# Altium schematic sheet SimpleFPGA_SI_Demo.SchDoc
size A3
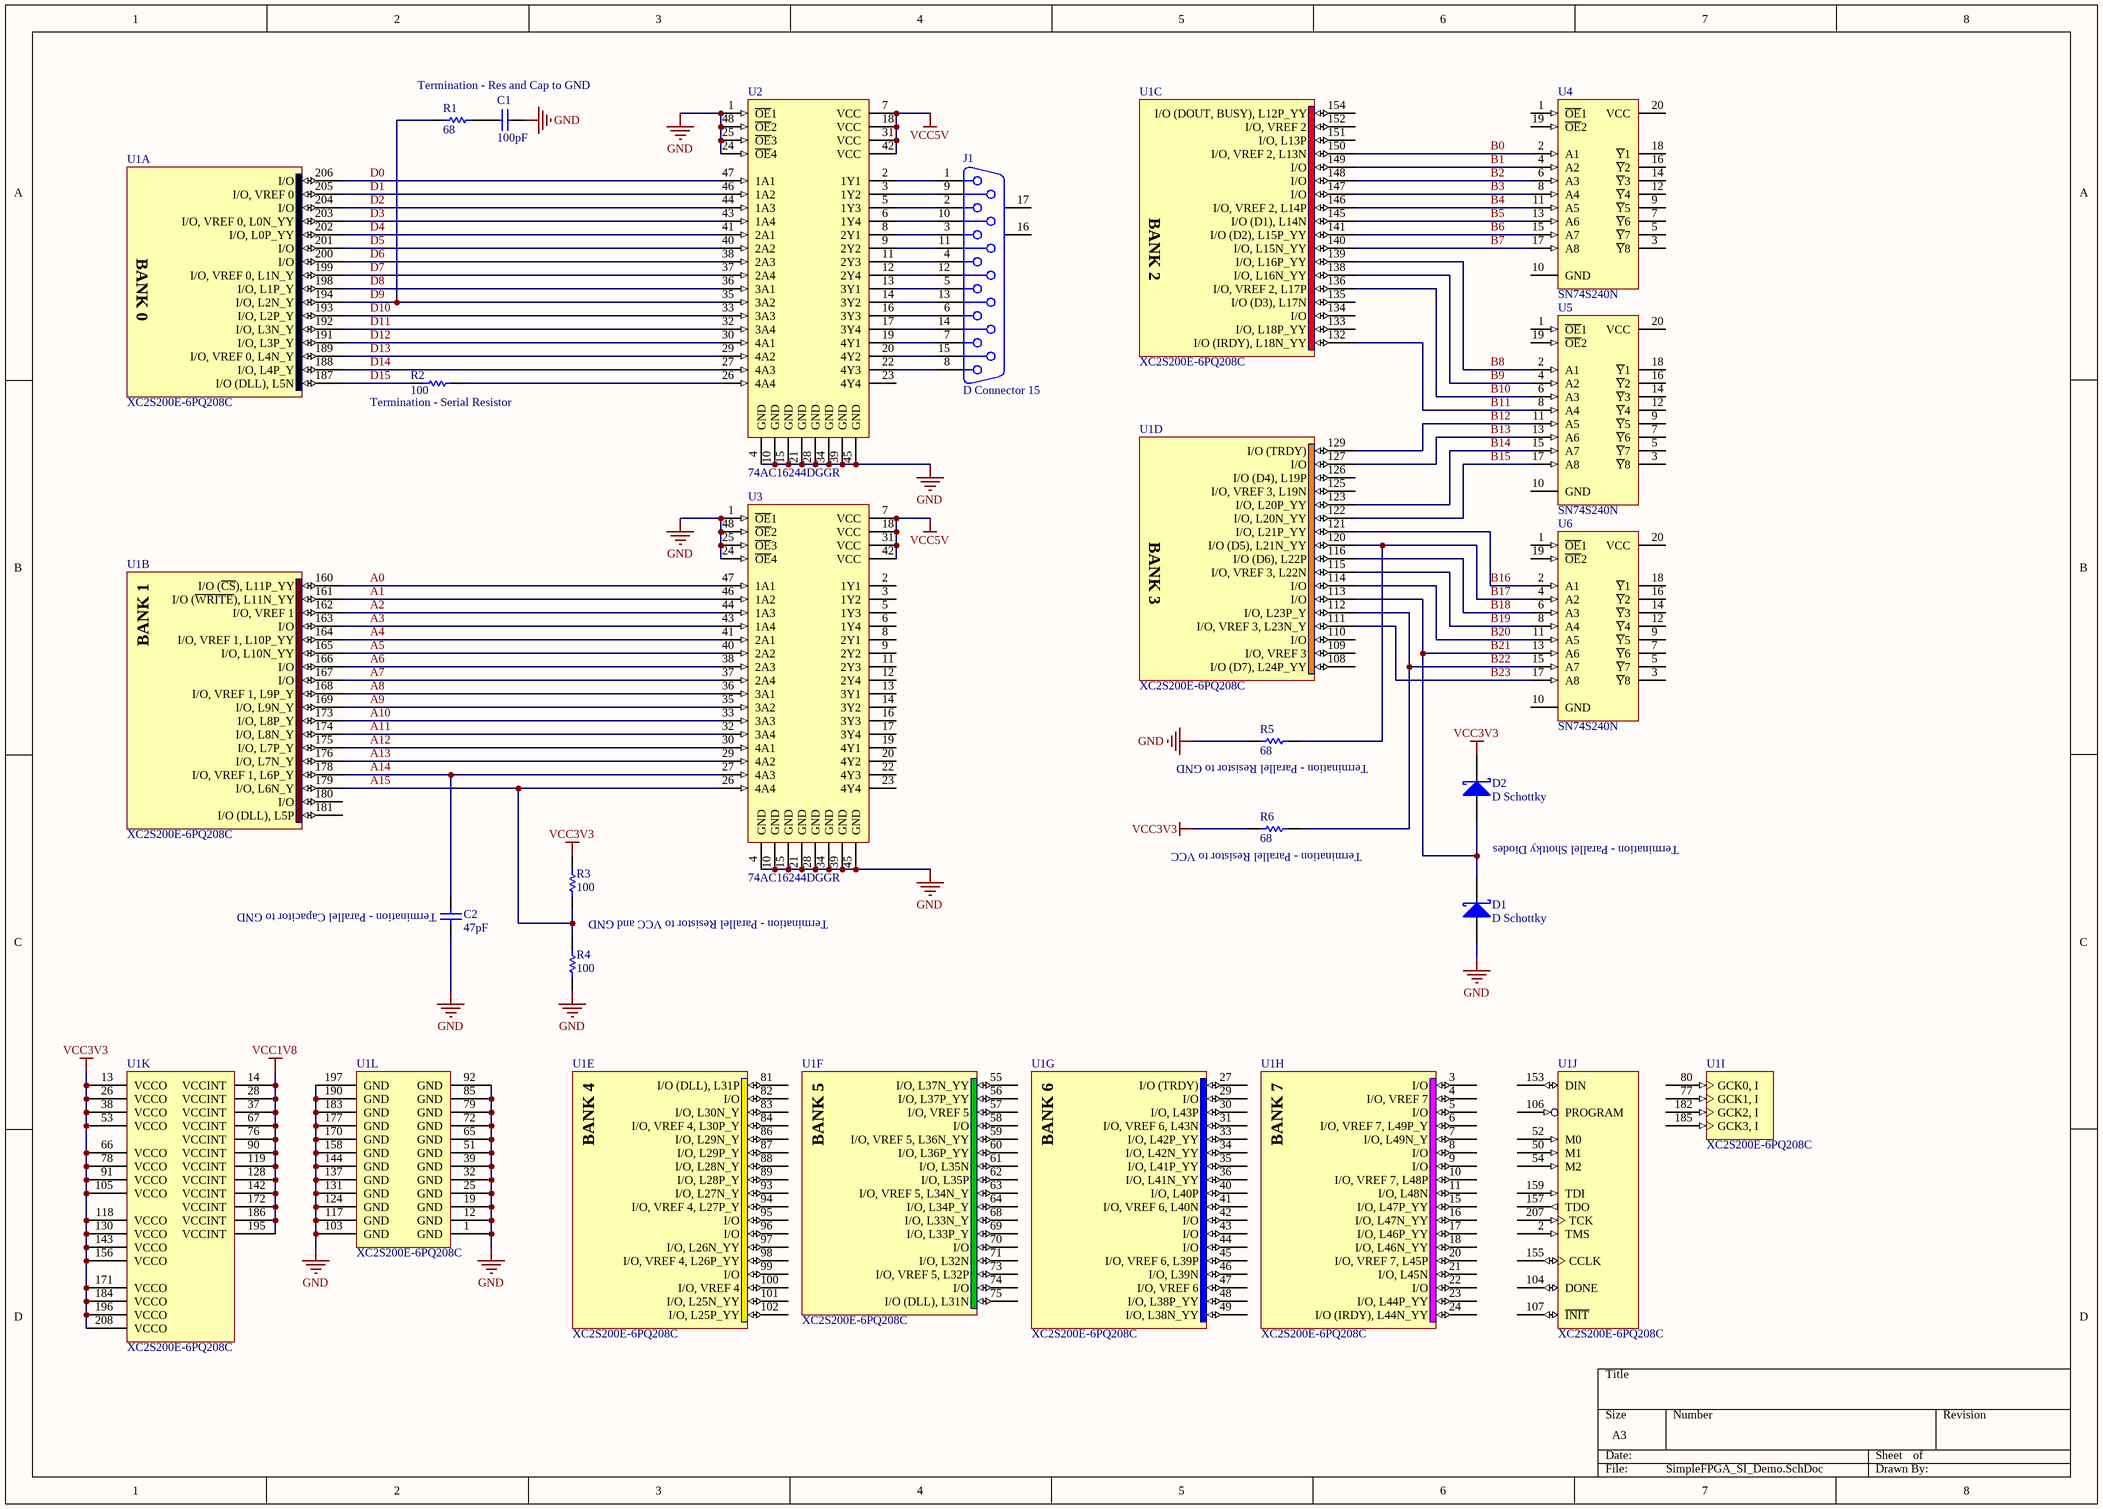
[diagram p0: SimpleFPGA_SI_Demo.SchDoc]

## Parts
C1  value 100pF  [RAD-0.3]  (hidden comment: Cap)
C2  value 47pF  [RAD-0.3]  (hidden comment: Cap)
D1  D Schottky  [SMB]
D2  D Schottky  [SMB]
J1  D Connector 15  [DSUB1.385-2H15]
R1  value 68  [AXIAL-0.3]  (hidden comment: Res1)
R2  value 100  [AXIAL-0.3]  (hidden comment: Res1)
R3  value 100  [AXIAL-0.3]  (hidden comment: Res1)
R4  value 100  [AXIAL-0.3]  (hidden comment: Res1)
R5  value 68  [AXIAL-0.3]  (hidden comment: Res1)
R6  value 68  [AXIAL-0.3]  (hidden comment: Res1)
U1  XC2S200E-6PQ208C  [PQ208_N]  (parts A,B,C,D,E,F,G,H,I,J,K,L of 12)
U2  74AC16244DGGR  [DGG048]
U3  74AC16244DGGR  [DGG048]
U4  SN74S240N  [N020]
U5  SN74S240N  [N020]
U6  SN74S240N  [N020]

## Nets
GND: C1.2 C2.1 D1.1(A) R4.1 R5.1 U1.1(GND) U1.12(GND) U1.19(GND) U1.25(GND) U1.32(GND) U1.39(GND) U1.51(GND) U1.65(GND) U1.72(GND) U1.79(GND) U1.85(GND) U1.92(GND) U1.103(GND) U1.117(GND) U1.124(GND) U1.131(GND) U1.137(GND) U1.144(GND) U1.158(GND) U1.170(GND) U1.177(GND) U1.183(GND) U1.190(GND) U1.197(GND) U2.1(~{OE}1) U2.4(GND) U2.10(GND) U2.15(GND) U2.21(GND) U2.24(~{OE}4) U2.25(~{OE}3) U2.28(GND) U2.34(GND) U2.39(GND) U2.45(GND) U2.48(~{OE}2) U3.1(~{OE}1) U3.4(GND) U3.10(GND) U3.15(GND) U3.21(GND) U3.24(~{OE}4) U3.25(~{OE}3) U3.28(GND) U3.34(GND) U3.39(GND) U3.45(GND) U3.48(~{OE}2)
VCC1V8: U1.14(VCCINT) U1.28(VCCINT) U1.37(VCCINT) U1.67(VCCINT) U1.76(VCCINT) U1.90(VCCINT) U1.119(VCCINT) U1.128(VCCINT) U1.142(VCCINT) U1.172(VCCINT) U1.186(VCCINT) U1.195(VCCINT)
VCC3V3: D2.2(K) R3.2 R6.1 U1.13(VCCO) U1.26(VCCO) U1.38(VCCO) U1.53(VCCO) U1.66(VCCO) U1.78(VCCO) U1.91(VCCO) U1.105(VCCO) U1.118(VCCO) U1.130(VCCO) U1.143(VCCO) U1.156(VCCO) U1.171(VCCO) U1.184(VCCO) U1.196(VCCO) U1.208(VCCO)
VCC5V: U2.7(VCC) U2.18(VCC) U2.31(VCC) U2.42(VCC) U3.7(VCC) U3.18(VCC) U3.31(VCC) U3.42(VCC)
A0: U1.160(I/O_(~{CS}),_L11P_YY) U3.47(1A1)
A1: U1.161(I/O_(~{WRITE}),_L11N_YY) U3.46(1A2)
A2: U1.162(I/O,_VREF_1) U3.44(1A3)
A3: U1.163(I/O) U3.43(1A4)
A4: U1.164(I/O,_VREF_1,_L10P_YY) U3.41(2A1)
A5: U1.165(I/O,_L10N_YY) U3.40(2A2)
A6: U1.166(I/O) U3.38(2A3)
A7: U1.167(I/O) U3.37(2A4)
A8: U1.168(I/O,_VREF_1,_L9P_Y) U3.36(3A1)
A9: U1.169(I/O,_L9N_Y) U3.35(3A2)
A10: U1.173(I/O,_L8P_Y) U3.33(3A3)
A11: U1.174(I/O,_L8N_Y) U3.32(3A4)
A12: U1.175(I/O,_L7P_Y) U3.30(4A1)
A13: U1.176(I/O,_L7N_Y) U3.29(4A2)
A14: C2.2 U1.178(I/O,_VREF_1,_L6P_Y) U3.27(4A3)
A15: R3.1 R4.2 U1.179(I/O,_L6N_Y) U3.26(4A4)
B0: U1.150(I/O,_VREF_2,_L13N) U4.2(A1)
B1: U1.149(I/O) U4.4(A2)
B2: U1.148(I/O) U4.6(A3)
B3: U1.147(I/O) U4.8(A4)
B4: U1.146(I/O,_VREF_2,_L14P) U4.11(A5)
B5: U1.145(I/O_(D1),_L14N) U4.13(A6)
B6: U1.141(I/O_(D2),_L15P_YY) U4.15(A7)
B7: U1.140(I/O,_L15N_YY) U4.17(A8)
B8: U1.139(I/O,_L16P_YY) U5.2(A1)
B9: U1.138(I/O,_L16N_YY) U5.4(A2)
B10: U1.136(I/O,_VREF_2,_L17P) U5.6(A3)
B11: U1.132(I/O_(IRDY),_L18N_YY) U5.8(A4)
B12: U1.129(I/O_(TRDY)) U5.11(A5)
B13: U1.127(I/O) U5.13(A6)
B14: U1.123(I/O,_L20P_YY) U5.15(A7)
B15: U1.122(I/O,_L20N_YY) U5.17(A8)
B16: U1.121(I/O,_L21P_YY) U6.2(A1)
B17: R5.2 U1.120(I/O_(D5),_L21N_YY) U6.4(A2)
B18: U1.116(I/O_(D6),_L22P) U6.6(A3)
B19: U1.115(I/O,_VREF_3,_L22N) U6.8(A4)
B20: U1.114(I/O) U6.11(A5)
B21: D1.2(K) D2.1(A) U1.113(I/O) U6.13(A6)
B22: R6.2 U1.112(I/O,_L23P_Y) U6.15(A7)
B23: U1.111(I/O,_VREF_3,_L23N_Y) U6.17(A8)
D0: U1.206(I/O) U2.47(1A1)
D1: U1.205(I/O,_VREF_0) U2.46(1A2)
D2: U1.204(I/O) U2.44(1A3)
D3: U1.203(I/O,_VREF_0,_L0N_YY) U2.43(1A4)
D4: U1.202(I/O,_L0P_YY) U2.41(2A1)
D5: U1.201(I/O) U2.40(2A2)
D6: U1.200(I/O) U2.38(2A3)
D7: U1.199(I/O,_VREF_0,_L1N_Y) U2.37(2A4)
D8: U1.198(I/O,_L1P_Y) U2.36(3A1)
D9: R1.1 U1.194(I/O,_L2N_Y) U2.35(3A2)
D10: U1.193(I/O,_L2P_Y) U2.33(3A3)
D11: U1.192(I/O,_L3N_Y) U2.32(3A4)
D12: U1.191(I/O,_L3P_Y) U2.30(4A1)
D13: U1.189(I/O,_VREF_0,_L4N_Y) U2.29(4A2)
D14: U1.188(I/O,_L4P_Y) U2.27(4A3)
D15: R2.1 U1.187(I/O_(DLL),_L5N)
NetC1_1: C1.1 R1.2
NetJ1_1: J1.1 U2.2(1Y1)
NetJ1_2: J1.2 U2.5(1Y3)
NetJ1_3: J1.3 U2.8(2Y1)
NetJ1_4: J1.4 U2.11(2Y3)
NetJ1_5: J1.5 U2.13(3Y1)
NetJ1_6: J1.6 U2.16(3Y3)
NetJ1_7: J1.7 U2.19(4Y1)
NetJ1_8: J1.8 U2.22(4Y3)
NetJ1_9: J1.9 U2.3(1Y2)
NetJ1_10: J1.10 U2.6(1Y4)
NetJ1_11: J1.11 U2.9(2Y2)
NetJ1_12: J1.12 U2.12(2Y4)
NetJ1_13: J1.13 U2.14(3Y2)
NetJ1_14: J1.14 U2.17(3Y4)
NetJ1_15: J1.15 U2.20(4Y2)
NetR2_2: R2.2 U2.26(4A4)

Not connected (* = marked no-connect by the designer): J1 16(MH1) 17(MH2); U1 2(TMS) 3(I/O) 4(I/O,_VREF_7) 5(I/O) 6(I/O,_VREF_7,_L49P_Y) 7(I/O,_L49N_Y) 8(I/O) 9(I/O) 10(I/O,_VREF_7,_L48P) 11(I/O,_L48N) 15(I/O,_L47P_YY) 16(I/O,_L47N_YY) 17(I/O,_L46P_YY) 18(I/O,_L46N_YY) 20(I/O,_VREF_7,_L45P) 21(I/O,_L45N) 22(I/O) 23(I/O,_L44P_YY) 24(I/O_(IRDY),_L44N_YY) 27(I/O_(TRDY)) 29(I/O) 30(I/O,_L43P) 31(I/O,_VREF_6,_L43N) 33(I/O,_L42P_YY) 34(I/O,_L42N_YY) 35(I/O,_L41P_YY) 36(I/O,_L41N_YY) 40(I/O,_L40P) 41(I/O,_VREF_6,_L40N) 42(I/O) 43(I/O) 44(I/O) 45(I/O,_VREF_6,_L39P) 46(I/O,_L39N) 47(I/O,_VREF_6) 48(I/O,_L38P_YY) 49(I/O,_L38N_YY) 50(M1) 52(M0) 54(M2) 55(I/O,_L37N_YY) 56(I/O,_L37P_YY) 57(I/O,_VREF_5) 58(I/O) 59(I/O,_VREF_5,_L36N_YY) 60(I/O,_L36P_YY) 61(I/O,_L35N) 62(I/O,_L35P) 63(I/O,_VREF_5,_L34N_Y) 64(I/O,_L34P_Y) 68(I/O,_L33N_Y) 69(I/O,_L33P_Y) 70(I/O) 71(I/O,_L32N) 73(I/O,_VREF_5,_L32P) 74(I/O) 75(I/O_(DLL),_L31N) 77(GCK1,_I) 80(GCK0,_I) 81(I/O_(DLL),_L31P) 82(I/O) 83(I/O,_L30N_Y) 84(I/O,_VREF_4,_L30P_Y) 86(I/O,_L29N_Y) 87(I/O,_L29P_Y) 88(I/O,_L28N_Y) 89(I/O,_L28P_Y) 93(I/O,_L27N_Y) 94(I/O,_VREF_4,_L27P_Y) 95(I/O) 96(I/O) 97(I/O,_L26N_YY) 98(I/O,_VREF_4,_L26P_YY) 99(I/O) 100(I/O,_VREF_4) 101(I/O,_L25N_YY) 102(I/O,_L25P_YY) 104(DONE) 106(PROGRAM) 107(~{INIT}) 108(I/O_(D7),_L24P_YY) 109(I/O,_VREF_3) 110(I/O) 125(I/O,_VREF_3,_L19N) 126(I/O_(D4),_L19P) 133(I/O,_L18P_YY) 134(I/O) 135(I/O_(D3),_L17N) 151(I/O,_L13P) 152(I/O,_VREF_2) 153(DIN) 154(I/O_(DOUT,_BUSY),_L12P_YY) 155(CCLK) 157(TDO) 159(TDI) 180(I/O) 181(I/O_(DLL),_L5P) 182(GCK2,_I) 185(GCK3,_I) 207(TCK); U2 23(4Y4); U3 2(1Y1) 3(1Y2) 5(1Y3) 6(1Y4) 8(2Y1) 9(2Y2) 11(2Y3) 12(2Y4) 13(3Y1) 14(3Y2) 16(3Y3) 17(3Y4) 19(4Y1) 20(4Y2) 22(4Y3) 23(4Y4); U4 1(~{OE}1) 3(~{Y}8) 5(~{Y}7) 7(~{Y}6) 9(~{Y}5) 10(GND) 12(~{Y}4) 14(~{Y}3) 16(~{Y}2) 18(~{Y}1) 19(~{OE}2) 20(VCC); U5 1(~{OE}1) 3(~{Y}8) 5(~{Y}7) 7(~{Y}6) 9(~{Y}5) 10(GND) 12(~{Y}4) 14(~{Y}3) 16(~{Y}2) 18(~{Y}1) 19(~{OE}2) 20(VCC); U6 1(~{OE}1) 3(~{Y}8) 5(~{Y}7) 7(~{Y}6) 9(~{Y}5) 10(GND) 12(~{Y}4) 14(~{Y}3) 16(~{Y}2) 18(~{Y}1) 19(~{OE}2) 20(VCC)

## Notes on the sheet
- Termination - Res and Cap to GND
- (near R2) Termination - Serial Resistor
- (near R5) Termination - Parallel Resistor to GND
- (near R6) Termination - Parallel Resistor to VCC
- Termination - Parallel Shottky Diodes
- (near C2) Termination - Parallel Capacitor to GND
- Termination - Parallel Resistor to VCC and GND
- (in symbol XC2S200E-6PQ208C, part A) BANK 0
- (in symbol XC2S200E-6PQ208C, part B) BANK 1
- (in symbol XC2S200E-6PQ208C, part C) BANK 2
- (in symbol XC2S200E-6PQ208C, part D) BANK 3
- (in symbol XC2S200E-6PQ208C, part E) BANK 4
- (in symbol XC2S200E-6PQ208C, part F) BANK 5
- (in symbol XC2S200E-6PQ208C, part G) BANK 6
- (in symbol XC2S200E-6PQ208C, part H) BANK 7

## Library data of the parts
C1 C2 = Cap: Capacitor; Published: 8-Jun-2000; LatestRevisionDate: 17-Jul-2002; LatestRevisionNote: Re-released for DXP Platform.; PackageReference: RAD-0.3; Publisher: Altium Limited
D1 D2 = D Schottky: Schottky Diode; Published: 8-Jun-2000; LatestRevisionDate: 17-Jul-2002; LatestRevisionNote: Re-released for DXP Platform.; PackageReference: SMB; Publisher: Altium Limited; Code_JEDEC: DO-214-AA
J1 = D Connector 15: Receptacle Assembly, 15 Position, Right Angle; PackageDocument: O; Positions: 15; Published: 15-Jun-2001; LatestRevisionDate: 17-Jul-2002; LatestRevisionNote: Re-released for DXP Platform.; DatasheetDocument: 1-Sep-99; PackageReference: 788757; Publisher: Altium Limited; Orientation: Right Angle; Gender: Receptacle
R1-R6 = Res1: Resistor; Published: 8-Jun-2000; LatestRevisionDate: 17-Jul-2002; LatestRevisionNote: Re-released for DXP Platform.; PackageReference: AXIAL-0.3; Publisher: Altium Limited
U1 = XC2S200E-6PQ208C: Spartan-IIE 1.8V FPGA, 208-Pin PQFP, Standard Performance, Commercial Grade; Published: 19-Jul-2002; LatestRevisionDate: 13-Apr-2006; LatestRevisionNote: IPC-7351 Footprint Added.; DatasheetVersion: 28-Jul-2004; PackageVersion: ver1.2, Jun-2004; PackageReference: PQ208; Publisher: Altium Limited; PackageDescription: 208-Pin Plastic Quad Flat Pack (PQ208); Code_JEDEC: MS-029-FA-1; ComponentLink1Description: Manufacturer Link; ComponentLink1URL: http://www.xilinx.com/xlnx/xil_prodcat_landingpage.jsp?title=Spartan-IIE; ComponentLink2Description: Datasheet; ComponentLink2URL: http://direct.xilinx.com/bvdocs/publications/ds077.pdf
U2 U3 = 74AC16244DGGR: 16-Bit Buffer/Line Driver with 3-State Outputs; Published: 8-Jun-2000; LatestRevisionDate: 06-Jun-2005; LatestRevisionNote: Stylized 3D Model Added.; DatasheetDocument: Apr-1996; PackageDocument: Jan-1998; PackageReference: DGG048; Publisher: Altium Limited; ComponentLink1Description: Manufacturer Link; ComponentLink1URL: http://www.ti.com/; ComponentLink2Description: Datasheet; ComponentLink2URL: http://www-s.ti.com/sc/ds/74ac16244.pdf
U4-U6 = SN74S240N: Octal Buffer and Line Driver with 3-State Outputs; Published: 8-Jun-2000; LatestRevisionDate: 06-Jun-2005; LatestRevisionNote: Stylized 3D Model Added.; DatasheetDocument: Mar-1988; PackageDocument: Oct-1995; PackageReference: N020; Publisher: Altium Limited; ComponentLink1Description: Manufacturer Link; ComponentLink1URL: http://www.ti.com/; ComponentLink2Description: Datasheet; ComponentLink2URL: http://www-s.ti.com/sc/ds/sn74s240.pdf